# EAGLE schematic shoff400 (EAGLE 7.0.0)
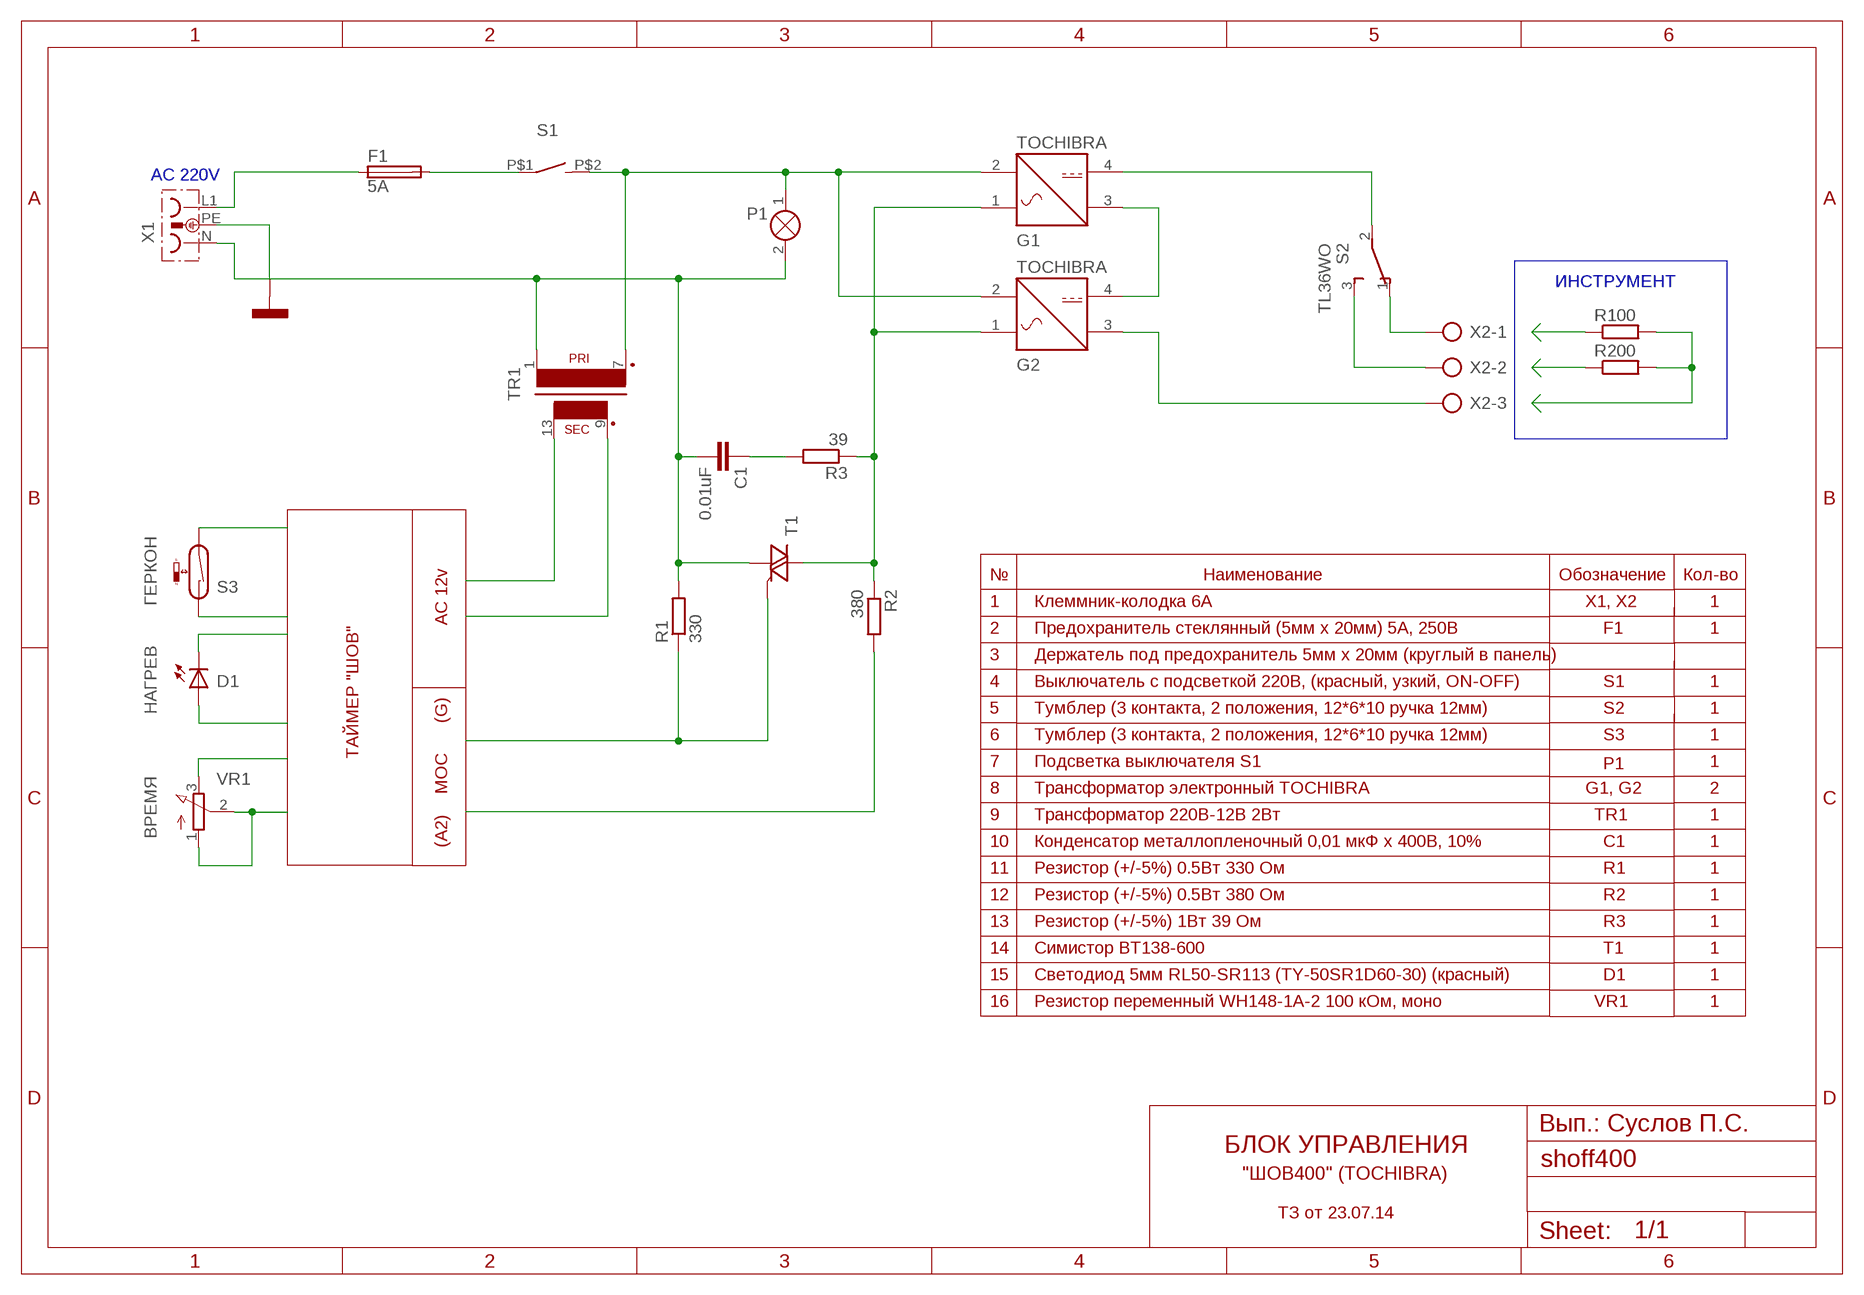
[diagram p0: schematic, sheet 1]

## Parts
C1  0.01uF  C-EU025-030X050  [C025-030X050]
F1  5A  GSH15  [GSH15]
G1  TOCHIBRA  NETZTEIL_GLEICHSPANNUNG  [NETZTEIL_GLEICHSPANNUNG]
G2  TOCHIBRA  NETZTEIL_GLEICHSPANNUNG  [NETZTEIL_GLEICHSPANNUNG]
GG  MASSE_ALLGEMEIN  [MASSE_ALLGEMEIN]
P1  SIGNALLAMPE  [LAMPE]
R1  330  R-EU_0207/5V  [0207/5V]
R2  380  R-EU_0207/5V  [0207/5V]
R3  39  R-EU_0207/5V  [0207/5V]
R100  R-EU_R0201  [R0201]
R200  R-EU_R0201  [R0201]
S1  SCHLIESSER_ARBEITSKONTAKT  [1]
S2  TL36WO  [TL3XWO]
S3  ГЕРКОН  REED-SWITCH-CT10-1530-G1  [CT10-G1]
T1  BTA26-V  [TOP3S-1]
TR1  BV054-5381.0K  [EI54-18,8_16VA]
X1  STECKDOSE  [STECKDOSE]
X2  AK500/3  [AK500/3]
ВРЕМЯ  3RP/1610N  [3RP/1610N]
ГОТОВ  НАГРЕВ  LED5MM  [LED5MM]

## Nets
MOC4: R1.1 T1.G
MOC6: R2.2
N$1: GG.1(0V) X1.PE
N$2: F1.1 X1.L1
N$3: F1.2 S1.P$1
N$4: TR1.9(S3)
N$5: G1.2 G2.2 P1.1(X1) S1.P$2 TR1.7(P2)
N$6: G1.1 G2.1 R2.1 R3.1 T1.A2
N$7: C1.2 P1.2(X2) R1.2 T1.A1 TR1.1 X1.N
N$8: C1.1 R3.2
N$9: TR1.13(S4)
N$10: G1.3 G2.4
N$11: G2.3 X2.3
N$13: G1.4 S2.2(P)
N$14: ГОТОВ.A
N$15: ГОТОВ.K(C)
N$16: S2.3(S) X2.2
N$17: S3.1
N$18: ВРЕМЯ.3(E)
N$19: ВРЕМЯ.1(A) ВРЕМЯ.2(S)
N$20: S3.2
N$21: S2.1(O) X2.1
N$22: R100.2 R200.2
N$23: R100.1
N$24: R200.1

## Buses
B$1

## Notes on the sheet
- AC 220V
- ИНСТРУМЕНТ
- № | Наименование | Обозначение | Кол-во
- 1 | Клеммник-колодка 6A | X1, X2 | 1
- AC 12v
- 2 | Предохранитель стеклянный (5мм х 20мм) 5А, 250В | F1 | 1
- 3 | Держатель под предохранитель 5мм х 20мм (круглый в панель)
- D1 | 4 | Выключатель с подсветкой 220В, (красный, узкий, ON-OFF) | S1 | 1
- 5 | Тумблер (3 контакта, 2 положения, 12*6*10 ручка 12мм) | S2 | 1
- (G)
- 6 | Тумблер (3 контакта, 2 положения, 12*6*10 ручка 12мм) | S3 | 1
- ТАЙМЕР "ШОВ"
- 7 | Подсветка выключателя S1 | P1 | 1
- VR1
- MOC | 8 | Трансформатор электронный TOCHIBRA | G1, G2 | 2
- 9 | Трансформатор 220В-12В 2Вт | TR1 | 1
- (A2) | 10 | Конденсатор металлопленочный 0,01 мкФ х 400В, 10% | C1 | 1
- 11 | Резистор (+/-5%) 0.5Вт 330 Ом | R1 | 1
- 12 | Резистор (+/-5%) 0.5Вт 380 Ом | R2 | 1
- 13 | Резистор (+/-5%) 1Вт 39 Ом | R3 | 1
- 14 | Симистор BT138-600 | T1 | 1
- 15 | Светодиод 5мм RL50-SR113 (TY-50SR1D60-30) (красный) | D1 | 1
- 16 | Резистор переменный WH148-1A-2 100 кОм, моно | VR1 | 1
- Вып.: Суслов П.С.
- БЛОК УПРАВЛЕНИЯ
- "ШОВ400" (TOCHIBRA)
- ТЗ от 23.07.14

## Library data of the parts
C1 = rcl:C-EU: CAPACITOR, European symbol
F1 = fuse:GSH15: FUSE HOLDER grid 15mm, 19649 Wickmann; MPN: 64900001039; OC_FARNELL: 1271673; OC_NEWARK: 02P0318
G1 G2 = e-stromversorgungselemente:NETZTEIL_GLEICHSPANNUNG: Netzteil, Gleichspannung
GG = e-klemmen:MASSE_ALLGEMEIN: Masse allgemein
P1 = e-lampen-signalisation:SIGNALLAMPE: Lampe
R1-R3 R100 R200 = rcl:R-EU_: RESISTOR, European symbol
S1 = e-symbole:SCHLIESSER_ARBEITSKONTAKT: Schließer (Arbeitskontakt)
S2 = switch:TL36WO: TINY SWITCH ON - ON Source: http://www2.produktinfo.conrad.com/datenblaetter/700000-724999/705152-da-01-de-Subminiaturschalter_TL_36WO.pdf
S3 = switch-reed:REED-SWITCH-: Reed Sensor; MF: COTO TECHNOLOGY; MPN: CT10-1530-G1; OC_FARNELL: 1081696
T1 = triac:BTA26: 25A TRIAC Source: http://www.st.com/stonline/products/literature/ds/7470.pdf
TR1 = trafo:BV054*: ERA EI 54/18,8 16 VA Distributor: RS-Component RS 207-5523 230V / 9V RS 207-9727 230V - 12V RS 207-5551 230V - 15V RS 207-5539 230V - 18V RS 207-5567 230V - 24V Source: 207-5567.pdf
X1 = e-steckverbinder:STECKDOSE: Steckdose mit Schutzleiter
X2 = con-ptr500:AK500/3: CONNECTOR; OC_FARNELL: unknown; OC_NEWARK: unknown
ВРЕМЯ = pot:3RP/1610N: 16mm Potentiometer one level Source: http://www.alphapotentiometers.net/html/16mm_pot_2.html
ГОТОВ = led:LED: LED OSRAM: - CHIPLED LG R971, LG N971, LY N971, LG Q971, LY Q971, LO R971, LY R971 LH N974, LH R974 LS Q976, LO Q976, LY Q976 LO Q996 - Hyper CHIPLED LW Q18S LB Q993, LB Q99A, LB R99A - SideLED LS A670, LO A670, LY A670, LG A670, LP A670 LB A673, LV A673, LT A673, LW A673 LH A674 LY A675 LS A676, LA A676, LO A676, LY A676, LW A676 LS A679, LY A679, LG A679 - Hyper Micro SIDELED® LS Y876, LA Y876, LO Y876, LY Y876 LT Y87S - SmartLED LW L88C, LW L88S LB L89C, LB L89S, LG L890 LS L89K, LO L89K, LY L89K LS L896, LA L896, LO L896, LY L896 - TOPLED LS T670, LO T670, LY T670, LG T670, LP T670 LSG T670, LSP T670, LSY T670, LOP T670, LYG T670 LG T671, LOG T671, LSG T671 LB T673, LV T673, LT T673, LW T673 LH T674 LS T676, LA T676, LO T676, LY T676, LB T676, LH T676, LSB T676, LW T676 LB T67C, LV T67C, LT T67C, LS T67K, LO T67K, LY T67K, LW E67C LS E67B, LA E67B, LO E67B, LY E67B, LB E67C, LV E67C, LT E67C LW T67C LS T679, LY T679, LG T679 LS T770, LO T770, LY T770, LG T770, LP T770 LB T773, LV T773, LT T773, LW T773 LH T774 LS E675, LA E675, LY E675, LS T675 LS T776, LA T776, LO T776, LY T776, LB T776 LHGB T686 LT T68C, LB T68C - Hyper Mini TOPLED® LB M676 - Mini TOPLED Santana® LG M470 LS M47K, LO M47K, LY M47K Source: http://www.osram.convergy.de LUXEON: - LUMILED® LXK2-PW12-R00, LXK2-PW12-S00, LXK2-PW14-U00, LXK2-PW14-V00 LXK2-PM12-R00, LXK2-PM12-S00, LXK2-PM14-U00 LXK2-PE12-Q00, LXK2-PE12-R00, LXK2-PE12-S00, LXK2-PE14-T00, LXK2-PE14-U00 LXK2-PB12-K00, LXK2-PB12-L00, LXK2-PB12-M00, LXK2-PB14-N00, LXK2-PB14-P00, LXK2-PB14-Q00 LXK2-PR12-L00, LXK2-PR12-M00, LXK2-PR14-Q00, LXK2-PR14-R00 LXK2-PD12-Q00, LXK2-PD12-R00, LXK2-PD12-S00 LXK2-PH12-R00, LXK2-PH12-S00 LXK2-PL12-P00, LXK2-PL12-Q00, LXK2-PL12-R00 Source: www.luxeon.com KINGBRIGHT: KA-3528ASYC Source: www.kingbright.com